# Altium project XXXX.426471.007 Secondary_PCB_Raspberry.PrjPcb
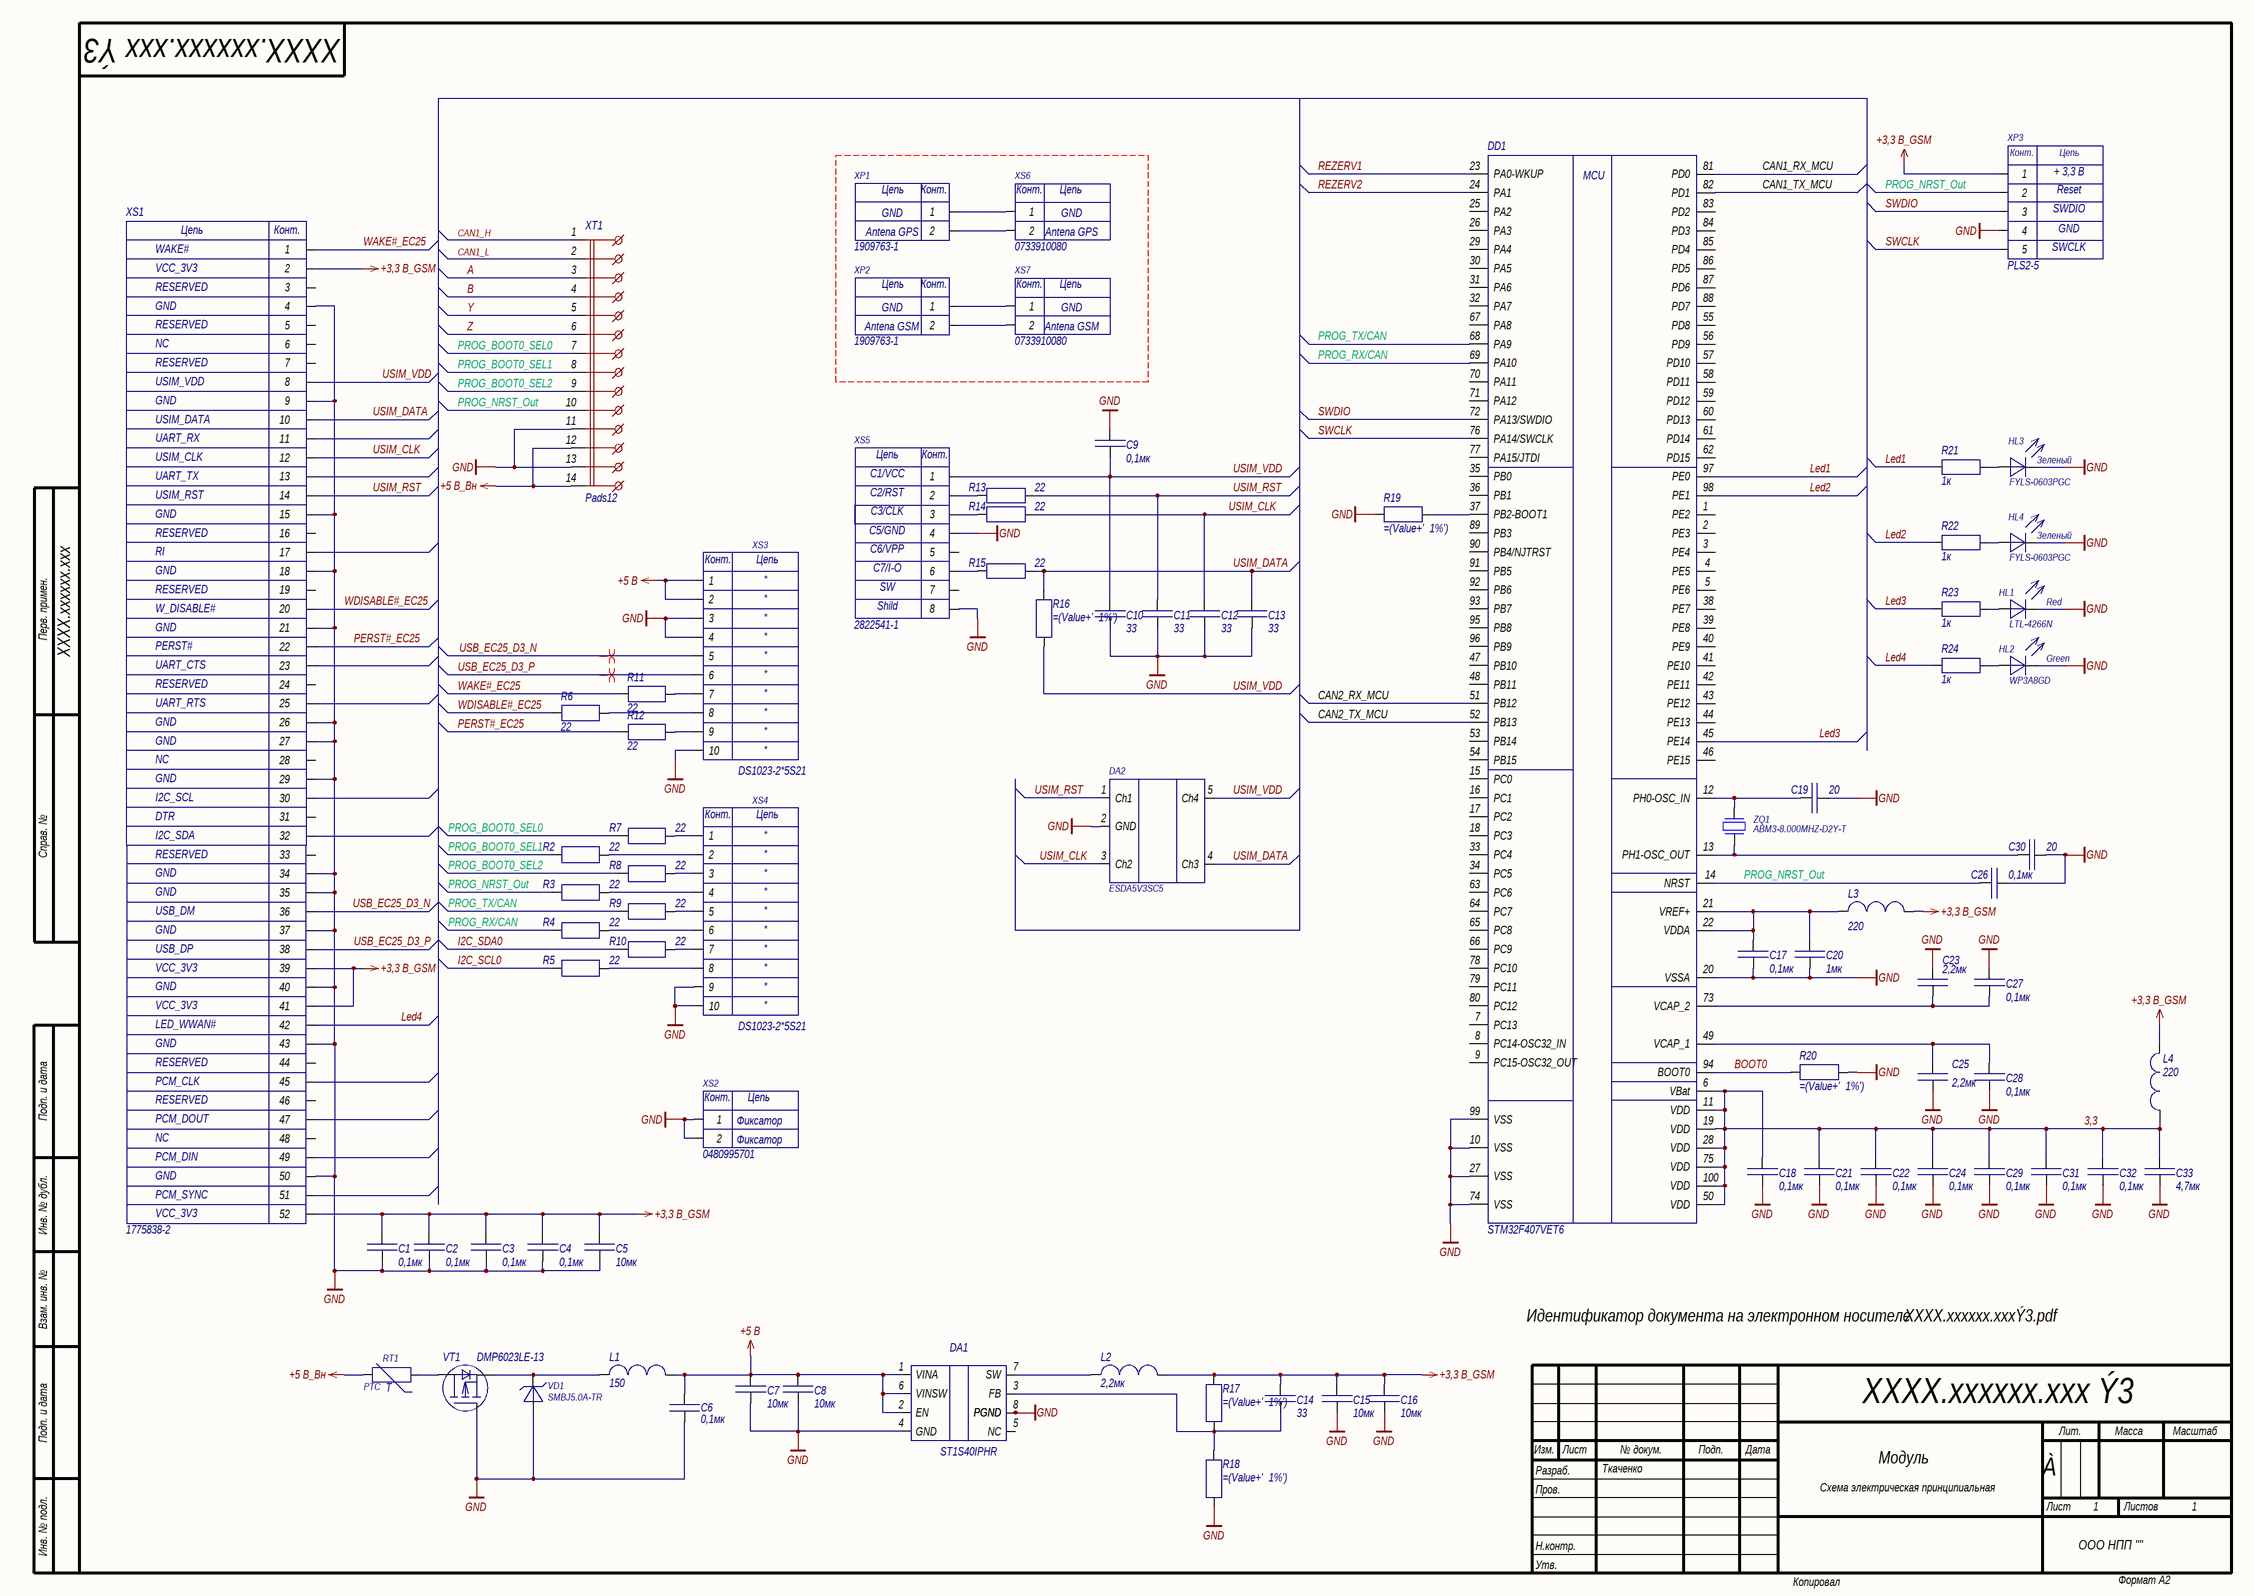
[diagram p0: XXXX.426471.007 Secondary_PCB_Raspberry_List1.SchDoc]
DocumentNumber: XXXX.xxxxxx.xxx Ý3; DocumentType2str: Схема электрическая принципиальная; DrawnBy: Ткаченко; IDENT: XXXX.xxxxxx.xxxÝ3.pdf; ImagePath: XXXX.xxxxxx.xxx; Letter1Column: À; Organization: ООО НПП ''''; pcbvalue: КНТР.777777.123; Title2str: Модуль
1 sheet, 82 parts. Net scope: global (net labels, ports and power ports of the same name join across sheets).
Board file: XXXX.687253.007.PcbDoc

## Sheet XXXX.426471.007 Secondary_PCB_Raspberry_List1.SchDoc
size 594 x 420 mm; DrawnBy: Ткаченко; Organization: ООО НПП ''''; DocumentNumber: XXXX.xxxxxx.xxx Ý3; SheetNumber: 1; SheetTotal: 1; Scale: 1:1; PageSetup: Record=PageOptions|CenterHorizontal=False|CenterVertical=False|PrintScale=0.95|XCorrection=0.00|YCorrection=0.00|PrintKind=1|BorderSize=5000000|LeftOffset=0|BottomOffset=0|Orientation=1|PaperLength=1000|PaperWidth=1000|Scale=100|PaperSource=15|PrintQuality=600|MediaType=1|DitherType=10|PaperKind=A4|PrintScaleMode=1; Title2str: Модуль; DocumentType2str: Схема электрическая принципиальная; TitleProject: Модуль; IDENT: XXXX.xxxxxx.xxxÝ3.pdf; ImagePath: XXXX.xxxxxx.xxx; Rule: PcbType=ProtelPcb

### Parts
C1  0,1мк  [CAPC1608N_SL]
C2  0,1мк  [CAPC1608N_SL]
C3  0,1мк  [CAPC1608N_SL]
C4  0,1мк  [CAPC1608N_SL]
C5  10мк  [CAPC2012N]
C6  0,1мк  [CAPC1608N_sl]
C7  10мк  [CAPC2012N]
C8  10мк  [CAPC2012N]
C9  0,1мк  [CAPC1608N_SL]
C10  33  [CAPC1608N_SL]
C11  33  [CAPC1608N_SL]
C12  33  [CAPC1608N_SL]
C13  33  [CAPC1608N_SL]
C14  33  [CAPC1608N_SL]
C15  10мк  [CAPC2012N]
C16  10мк  [CAPC2012N]
C17  0,1мк  [CAPC1608N_SL]
C18  0,1мк  [CAPC1608N_SL]
C19  20  [CAPC1608N_SL]
C20  1мк  [CAPC1608N_SL]
C21  0,1мк  [CAPC1608N_SL]
C22  0,1мк  [CAPC1608N_SL]
C23  2,2мк  [CAPC1608N_SL]
C24  0,1мк  [CAPC1608N_SL]
C25  2,2мк  [CAPC1608N_SL]
C26  0,1мк  [CAPC1608N_SL]
C27  0,1мк  [CAPC1608N_SL]
C28  0,1мк  [CAPC1608N_SL]
C29  0,1мк  [CAPC1608N_SL]
C30  20  [CAPC1608N_SL]
C31  0,1мк  [CAPC1608N_SL]
C32  0,1мк  [CAPC1608N_SL]
C33  4,7мк  [CAPC1608N_SL]
DA1  ST1S40IPHR  [HSOP-8]
DA2  ESDA5V3SC5  [SOT23-5AN]
DD1  STM32F407VET6  [LQFP100]
HL1  LTL-4266N  NoteSCH: Red  [Led3mm]
HL2  WP3A8GD  NoteSCH: Green  [LED-2.5_G]
HL3  FYLS-0603PGC  NoteSCH: Зеленый  [HL0603_GREEN_SL]
HL4  FYLS-0603PGC  NoteSCH: Зеленый  [HL0603_GREEN_SL]
L1  150  [INDC_56x51]
L2  2,2мк  [sru1048]
L3  220  [L2012N]
L4  220  [L2012N]
R2  22  [RESC1608N_SL]
R3  22  [RESC1608N_SL]
R4  22  [RESC1608N_SL]
R5  22  [RESC1608N_SL]
R6  22  [RESC1608N_SL]
R7  22  [RESC1608N_SL]
R8  22  [RESC1608N_SL]
R9  22  [RESC1608N_SL]
R10  22  [RESC1608N_SL]
R11  22  [RESC1608N_SL]
R12  22  [RESC1608N_SL]
R13  22  [RESC1608N_SL]
R14  22  [RESC1608N_SL]
R15  22  [RESC1608N_SL]
R16  (no value)  [RESC1608N_SL]
R17  (no value)  [RESC1608N_SL]
R18  (no value)  [RESC1608N_SL]
R19  (no value)  [RESC1608N_SL]
R20  (no value)  [RESC1608N_SL]
R21  1к  [RESC1608N_SL]
R22  1к  [RESC1608N_SL]
R23  1к  [RESC1608N_SL]
R24  1к  [RESC1608N_SL]
RT1  PTC  [Fuse_2920]
VD1  SMBJ5.0A-TR  [DO-214AA(SMB)]
VT1  DMP6023LE-13  [SOT230P700X180-3M]
XP1  1909763-1  Net_Name1: GND  Net_Name2: Antena GPS  [1909763-1]
XP2  1909763-1  Net_Name1: GND  Net_Name2: Antena GSM  [1909763-1]
XP3  PLS2-5  Net_Name1: + 3,3 В  Net_Name2: Reset  Net_Name3: SWDIO  Net_Name4: GND  Net_Name5: SWCLK  [PLS2-5]
XS1  1775838-2  Net_Name3: RESERVED  Net_Name4: GND  Net_Name6: NC  Net_Name8: USIM_VDD  Net_Name10: USIM_DATA  Net_Name11: UART_RX  Net_Name12: USIM_CLK  Net_Name13: UART_TX  Net_Name14: USIM_RST  Net_Name17: RI  Net_Name20: W_DISABLE#  Net_Name22: PERST#  Net_Name23: UART_CTS  Net_Name25: UART_RTS  Net_Name30: I2C_SCL  Net_Name31: DTR  Net_Name32: I2C_SDA  Net_Name36: USB_DM  Net_Name38: USB_DP  Net_Name39: VCC_3V3  Net_Name1: WAKE#  Net_Name42: LED_WWAN#  Net_Name45: PCM_CLK  Net_Name47: PCM_DOUT  Net_Name49: PCM_DIN  Net_Name51: PCM_SYNC  [2041119-1CB]
XS2  0480995701  Net_Name1: Фиксатор  [NoPackage]
XS3  DS1023-2*5S21  [pbD-10]
XS4  DS1023-2*5S21  [pbD-10]
XS5  2822541-1  Net_Name1: C1/VCC  Net_Name2: C2/RST  Net_Name3: C3/CLK  Net_Name4: C5/GND  Net_Name5: C6/VPP  Net_Name6: C7/I-O  Net_Name7: SW  Net_Name8: Shild  [2822541-1_MSIM]
XS6  0733910080  Net_Name1: GND  Net_Name2: Antena GPS  [0733910080]
XS7  0733910080  Net_Name1: GND  Net_Name2: Antena GSM  [0733910080]
XT1  Pads12  [pads12]
ZQ1  ABM3-8.000MHZ-D2Y-T  [ABM3]

### Nets
+3,3 В_GSM: C1.1 C2.1 C3.1 C4.1 C5.1 C14.1 C15.1 C16.1 L2.2 L3.2 L4.2 R17.2 XP3.1 XS1.2 XS1.39 XS1.41 XS1.52
+5 В: C6.1 C7.1 C8.1 DA1.1(VINA) DA1.2(EN) DA1.6(VINSW) L1.2 XS3.1 XS3.2
+5 В_Вн: RT1.1 XT1.12 XT1.14
GND: C1.2 C2.2 C3.2 C4.2 C5.2 C6.2 C7.2 C8.2 C9.2 C10.2 C11.2 C12.2 C13.2 C15.2 C16.2 C17.2 C18.2 C19.1 C20.2 C21.2 C22.2 C23.2 C24.2 C25.1 C26.1 C27.1 C28.2 C29.2 C30.1 C31.2 C32.2 C33.2 DA1.4(GND) DA1.8(PGND) DA1.9(PGND) DA2.2(GND) DD1.10(VSS) DD1.20(VSSA) DD1.27(VSS) DD1.74(VSS) DD1.99(VSS) HL1.1 HL2.1 HL3.1 HL4.1 R18.1 R19.1 R20.2 VD1.2(A) VT1.1(G) XP3.4 XS1.4 XS1.9 XS1.15 XS1.18 XS1.21 XS1.26 XS1.27 XS1.29 XS1.34 XS1.35 XS1.37 XS1.40 XS1.43 XS1.50 XS2.1 XS2.2 XS3.3 XS3.4 XS3.10 XS4.9 XS4.10 XS5.4 XS5.8 XT1.11 XT1.13
3,3: C18.1 C21.1 C22.1 C24.1 C29.1 C31.1 C32.1 C33.1 DD1.6(VBat) DD1.11(VDD) DD1.19(VDD) DD1.28(VDD) DD1.50(VDD) DD1.75(VDD) DD1.100(VDD) L4.1
A: XT1.3
B: XT1.4
BOOT0: DD1.94(BOOT0) R20.1
CAN1_H: XT1.1
CAN1_L: XT1.2
CAN1_RX_MCU: DD1.81(PD0)
CAN1_TX_MCU: DD1.82(PD1)
CAN2_RX_MCU: DD1.51(PB12)
CAN2_TX_MCU: DD1.52(PB13)
I2C_SCL0: R5.2
I2C_SDA0: R10.2
Led1: DD1.97(PE0) R21.1
Led2: DD1.98(PE1) R22.1
Led3: DD1.45(PE14) R23.1
Led4: R24.1 XS1.42
PERST#_EC25: R12.2 XS1.22
PROG_BOOT0_SEL0: R7.2 XT1.7
PROG_BOOT0_SEL1: R2.2 XT1.8
PROG_BOOT0_SEL2: R8.2 XT1.9
PROG_NRST_Out: C26.2 DD1.14(NRST) R3.2 XP3.2 XT1.10
PROG_RX/CAN: DD1.69(PA10) R4.2
PROG_TX/CAN: DD1.68(PA9) R9.2
REZERV1: DD1.23(PA0-WKUP)
REZERV2: DD1.24(PA1)
SWCLK: DD1.76(PA14/SWCLK) XP3.5
SWDIO: DD1.72(PA13/SWDIO) XP3.3
USB_EC25_D3_N: XS1.36 XS3.5
USB_EC25_D3_P: XS1.38 XS3.6
USIM_CLK: C12.1 DA2.3(Ch2) R14.2 XS1.12
USIM_DATA: C13.1 DA2.4(Ch3) R15.2 R16.2 XS1.10
USIM_RST: C11.1 DA2.1(Ch1) R13.2 XS1.14
USIM_VDD: C9.1 C10.1 DA2.5(Ch4) R16.1 XS1.8 XS5.1
WAKE#_EC25: R11.2 XS1.1
WDISABLE#_EC25: R6.2 XS1.20
Y: XT1.5
Z: XT1.6
NetC14_2: C14.2 DA1.3(FB) R17.1 R18.2
NetC17_1: C17.1 C20.1 DD1.21(VREF+) DD1.22(VDDA) L3.1
NetC19_2: C19.2 DD1.12(PH0-OSC_IN) ZQ1.2
NetC23_1: C23.1 C27.2 DD1.73(VCAP_2)
NetC25_2: C25.2 C28.1 DD1.49(VCAP_1)
NetC30_2: C30.2 DD1.13(PH1-OSC_OUT) ZQ1.1
NetDA1_7: DA1.7(SW) L2.1
NetDD1_37: DD1.37(PB2-BOOT1) R19.2
NetHL1_2: HL1.2 R23.2
NetHL2_2: HL2.2 R24.2
NetHL3_2: HL3.2 R21.2
NetHL4_2: HL4.2 R22.2
NetL1_1: L1.1 VD1.1(C) VT1.3(S)
NetR2_1: R2.1 XS4.2
NetR3_1: R3.1 XS4.4
NetR4_1: R4.1 XS4.6
NetR5_1: R5.1 XS4.8
NetR6_1: R6.1 XS3.8
NetR7_1: R7.1 XS4.1
NetR8_1: R8.1 XS4.3
NetR9_1: R9.1 XS4.5
NetR10_1: R10.1 XS4.7
NetR11_1: R11.1 XS3.7
NetR12_1: R12.1 XS3.9
NetR13_1: R13.1 XS5.2
NetR14_1: R14.1 XS5.3
NetR15_1: R15.1 XS5.6
NetRT1_2: RT1.2 VT1.2(D)
NetXP1_1: XP1.1 XS6.1
NetXP1_2: XP1.2 XS6.2
NetXP2_1: XP2.1 XS7.1
NetXP2_2: XP2.2 XS7.2

Not connected (* = marked no-connect by the designer): DA1 5(NC); DD1 1(PE2) 2(PE3) 3(PE4) 4(PE5) 5(PE6) 7(PC13) 8(PC14-OSC32_IN) 9(PC15-OSC32_OUT) 15(PC0) 16(PC1) 17(PC2) 18(PC3) 25(PA2) 26(PA3) 29(PA4) 30(PA5) 31(PA6) 32(PA7) 33(PC4) 34(PC5) 35(PB0) 36(PB1) 38(PE7) 39(PE8) 40(PE9) 41(PE10) 42(PE11) 43(PE12) 44(PE13) 46(PE15) 47(PB10) 48(PB11) 53(PB14) 54(PB15) 55(PD8) 56(PD9) 57(PD10) 58(PD11) 59(PD12) 60(PD13) 61(PD14) 62(PD15) 63(PC6) 64(PC7) 65(PC8) 66(PC9) 67(PA8) 70(PA11) 71(PA12) 77(PA15/JTDI) 78(PC10) 79(PC11) 80(PC12) 83(PD2) 84(PD3) 85(PD4) 86(PD5) 87(PD6) 88(PD7) 89(PB3) 90(PB4/NJTRST) 91(PB5) 92(PB6) 93(PB7) 95(PB8) 96(PB9); XS1 3 5 6 7 11 13 16 17 19 23 24 25 28 30 31 32 33 44 45 46 47 48 49 51; XS5 5 7

### Layout directives
differential pair: USB_EC25_D3_N, USB_EC25_D3_P

### Notes on the sheet
- Перв. примен.
- Справ. №
- Подп. и дата
- Инв. № дубл.
- Взам. инв. №
- Идентификатор документа на электронном носителе
- Изм.
- Лист
- № докум.
- Подп.
- Дата
- Лит.
- Масса
- Масштаб
- Пров.
- Разраб.
- Листов
- Инв. № подл.
- Н.контр.
- Утв.
- Копировал
- Формат А2
- (in symbol 2920L600/12MR_Littelfuse) T
- (in symbol 1775838-2_TE Connectivity) Цепь; Конт.
- (in symbol 1909763-1_TE Connectivity) Цепь; Конт.
- (in symbol 2822541-1_TE Connectivity) Цепь; Конт.
- (in symbol 0480995701_Molex) Конт.; Цепь
- (in symbol 0733910080_Molex) Конт.; Цепь
- (in symbol DS1023-2*5S21_CONNFLY) Конт.; Цепь
- (in symbol PLS2-5_CONNFLY) Конт.; Цепь

### Library data of the parts
C1-C4 C6 C9 C17 C18 C21 C22 C24 C26-C29 C31 C32 = CC0603KRX7R9BB104_Yageo: CAP CER 0.1UF 50V 10% X7R 0603; Manufacturer: Yageo; Voltage: 50 В; ValueBOM: Конденсатор CC0603KRX7R9BB104 "Yageo" (0,1 мкФ ± 10 %, 50 В,X7R, SMD 0603); Sorting: 100000; Автор: Хоменко С.П.; Количество1: 10; Цена1: 0,027; Количество2: 100; Цена2: 0,0125; Разрешен к применению: True; PartNumber: CC0603KRX7R9BB104_Yageo; ManufacturerPartNumber: CC0603KRX7R9BB104; ComponentLink3URL: http://www.yageo.com/documents/recent/UPY-GPHC_X7R_6.3V-to-50V-v12.pdf; ComponentLink3Description: Datasheet; Value: 0,1мк; Tolerance: ± 10 %; TKE: X7R; ComponentLink2Description: Manufacturer Link; ComponentLink2URL: http://www.yageo.com/; Operating Temperature: -55°C ~ +125°C; Modify: 06.07.2015; Supplier: Digi-Key; Supplier P/N: 311-1344-1-ND
C5 C7 C8 C15 C16 = GCM21BR71A106KE22L_Murata Electronics: CAP CER 10UF 10V 10% X7R 0805; Voltage: 10 В; ValueBOM: Конденсатор GCM21BR71A106KE22L "Murata Electronics" (10 мкФ ± 10 %, 10 В, X7R, SMD 0805); Sorting: 10000000; Автор: Хоменко С.П.; Количество1: 10; Цена1: 0,496; Количество2: 50; Цена2: 0,296; Разрешен к применению: False; PartNumber: GCM21BR71A106KE22L_Murata Electronics; Manufacturer: Murata Electronics; ManufacturerPartNumber: GCM21BR71A106KE22L; ComponentLink3URL: http://search.murata.co.jp/Ceramy/image/img/w_hinm/S0717E.pdf; ComponentLink3Description: Datasheet; Value: 10мк; Tolerance: ± 10 %; TKE: X7R; ComponentLink2Description: Manufacturer Link; ComponentLink2URL: http://www.murata.com/; Operating Temperature: -55°C ~ +125°C; Modify: 07.09.2015; Supplier: Digi-Key; Supplier P/N: 490-10674-1-ND
C10-C14 = CC0603JRNPO9BN330_Yageo: CAP CER 33PF 50V NPO 0603; Manufacturer: Yageo; Tolerance: ± 5 %; Voltage: 50 В; TKE: NP0; ValueBOM: Конденсатор CC0603JRNPO9BN330 "Yageo" (33 пФ ± 5 %, 50 В, NP0, SMD 0603); Автор: Хоменко С.П.; Количество1: 10; Цена1: 0,029; Количество2: 25; Цена2: 0,0204; Разрешен к применению: True; PartNumber: CC0603JRNPO9BN330_Yageo; ManufacturerPartNumber: CC0603JRNPO9BN330; ComponentLink3URL: http://www.yageo.com/documents/recent/UPY-GP_NP0_16V-to-50V_10.pdf; ComponentLink3Description: Datasheet; Value: 33; ComponentLink2Description: Manufacturer Link; ComponentLink2URL: http://www.yageo.com/; Operating Temperature: -55°C ~ +125°C; Modify: 22.01.2016; Supplier: Digi-Key; Supplier P/N: 311-1064-1-ND; Sorting: 33
C19 C30 = CC0603JRNPO9BN200_Yageo: CAP CER 20PF 50V 5% NPO 0603; Manufacturer: Yageo; Voltage: 50 В; TKE: NP0; ValueBOM: Конденсатор CC0603JRNPO9BN200 "Yageo" (20 пФ ± 10 %, 50 В,NP0, SMD 0603); Автор: Хоменко С.П.; Количество1: 10; Цена1: 0,031; Количество2: 25; Цена2: 0,0216; Разрешен к применению: True; PartNumber: CC0603JRNPO9BN200_Yageo; ManufacturerPartNumber: CC0603JRNPO9BN200; ComponentLink3URL: http://www.yageo.com/documents/recent/UPY-GPHC_X7R_6.3V-to-50V-v12.pdf; ComponentLink3Description: Datasheet; Value: 20; Tolerance: ± 5 %; ComponentLink2Description: Manufacturer Link; ComponentLink2URL: http://www.yageo.com/; Operating Temperature: -55°C ~ +125°C; Modify: 12.08.2015; Supplier: Digi-Key; Supplier P/N: 311-1424-1-ND; Sorting: 20
C20 = CC0603KRX7R7BB105_Yageo: CAP CER 1UF 16V 10% X7R 0603; Manufacturer: Yageo; Voltage: 16 В; ValueBOM: Конденсатор CC0603KRX7R7BB105 "Yageo" (1 мкФ ± 10 %, 16 В,X7R, SMD 0603); Sorting: 1000000; Автор: Хоменко С.П.; Количество1: 10; Цена1: 0,44; Количество2: 25; Цена2: 0,031; Разрешен к применению: True; PartNumber: CC0603KRX7R7BB105_Yageo; ManufacturerPartNumber: CC0603KRX7R7BB105; ComponentLink3URL: http://www.yageo.com/documents/recent/UPY-GPHC_X7R_6.3V-to-50V-v12.pdf; ComponentLink3Description: Datasheet; Value: 1мк; Tolerance: ± 10 %; TKE: X7R; ComponentLink2Description: Manufacturer Link; ComponentLink2URL: http://www.yageo.com/; Operating Temperature: -55°C ~ +125°C; Modify: 12.08.2015 16:30:29; Supplier: Digi-Key; Supplier P/N: 311-1446-1-ND
C23 C25 = GRM188R71A225KE15D_Murata Electronics: CAP CER 2.2UF 10V X7R 0603; Tolerance: ± 10 %; Voltage: 10 В; ValueBOM: Конденсатор GRM188R71A225KE15D "Murata Electronics" (2,2 мкФ ± 10 %, 10 В, X7R, SMD 0603); Sorting: 2200000; Автор: Хоменко С.П.; Количество1: 1; Цена1: 0,34; Количество2: 10; Цена2: 0,28; Разрешен к применению: False; PartNumber: GRM188R71A225KE15D_Murata Electronics; Manufacturer: Murata Electronics; ManufacturerPartNumber: GRM188R71A225KE15D; ComponentLink3URL: http://www.murata.com/~/media/webrenewal/support/library/catalog/products/capacitor/mlcc/c02e.pdf; ComponentLink3Description: Datasheet; Value: 2,2мк; TKE: X7R; ComponentLink2Description: Manufacturer Link; ComponentLink2URL: http://www.murata.com/; Operating Temperature: -55°C ~ +125°C; Modify: 29.03.2016 8:54:49; Supplier: Digi-Key; Supplier P/N: 490-4520-1-ND
C33 = CC0603KRX5R6BB475_Yageo: CAP CER 4.7UF 10V 10% X5R 0603; Manufacturer: Yageo; Voltage: 10 В; ValueBOM: Конденсатор CC0603KRX5R6BB475 "Yageo" (4,7 мкФ ± 10 %, 10 В, X5R, SMD 0603); Sorting: 4700000; Автор: Хоменко С.П.; Количество1: 1; Цена1: 0,14; Количество2: 10; Цена2: 0,095; Разрешен к применению: False; PartNumber: CC0603KRX5R6BB475_Yageo; ManufacturerPartNumber: CC0603KRX5R6BB475; ComponentLink3URL: http://www.yageo.com/documents/recent/UPY-GPHC_X5R_4V-to-50V_19.pdf; ComponentLink3Description: Datasheet; Value: 4,7мк; Tolerance: ± 10 %; TKE: X5R; ComponentLink2Description: Manufacturer Link; ComponentLink2URL: http://www.yageo.com/; Operating Temperature: -55°C ~ +125°C; Modify: 12.08.2015 16:02:03; Supplier: Digi-Key; Supplier P/N: 311-1455-1-ND
DA1 = ST1S40IPHR_STMicroelectronics: IC REG BUCK ADJ 3A SYNC 8-HSOP; ValueBOM: Микросхема  ST1S40IPHR STMicroelectronics; Expr1007: 3,0  - 18  В; Автор: Ткаченко М.; Количество1: 1; Цена1: 1,6; Количество2: 10; Цена2: 1,5; Разрешен к применению: True; PartNumber: ST1S40IPHR_STMicroelectronics; ManufacturerPartNumber: ST1S40IPHR; Manufacturer: STMicroelectronics; ComponentLink3URL: http://www.st.com/content/ccc/resource/technical/document/datasheet/56/bd/d6/2b/e1/d4/49/d9/CD00284753.pdf/files/CD00284753.pdf/_jcr_content/translations/en.CD00284753.pdf; ComponentLink3Description: Datasheet; Value: ST1S40IPHR; Expr1008: 3 A; ComponentLink2Description: Manufacturer Link; ComponentLink2URL: http://www.st.com; Operating Temperature: -40°C ~ +85°C; Modify: 07.08.2017 17:29:54; Supplier: Digi-Key; Supplier P/N: 497-13025-1-ND; Voltage: 3,0  - 18  В; Current: 3 A; Package: HSOP-8; SMD mounting: True
DA2 = ESDA5V3SC5_STMicroelectronics: TVS DIODE 3V SOT23-5L; ValueBOM: TVS диод ESDA5V3SC5 "STMicroelectronics" SOT23-5; Marking: EC53; Voltage: 5,0 В; Current: 500 W; Автор: Ткаченко М.; Количество1: 1; Цена1: 0,42; Количество2: 10; Цена2: 0,35; Разрешен к применению: True; PartNumber: ESDA5V3SC5_STMicroelectronics; ManufacturerPartNumber: ESDA5V3SC5; Manufacturer: STMicroelectronics; ComponentLink3Description: Datasheet; Value: ESDA5V3SC5; ComponentLink2Description: Manufacturer Link; ComponentLink2URL: http://www.st.com; Operating Temperature: -40°C ~ +85°C; Modify: 15.04.2019 14:38:55; Supplier: Digi-Key; Supplier P/N: 497-7746-1-ND; Package Description: Корпус SOT23-5
DD1 = STM32F407VET6_STMicroelectronics: STM32F407VET6, Микроконтроллер 32-Бит, Cortex-M4 + FPU, 168МГц, 512КБ Flash, USB OTG HS/FS, Ethernet [LQFP-100]; ValueBOM: Микросхема  STM32F407VET6 "STMicroelectronics"; Voltage: 3,3 В; Автор: Ткаченко М.; Количество1: 1; Цена1: 7,5; Количество2: 10; Разрешен к применению: True; Current: 150 мА; PartNumber: STM32F407VET6_STMicroelectronics; ManufacturerPartNumber: STM32F407VET6; Manufacturer: STMicroelectronics; ComponentLink3URL: https://www.st.com/content/ccc/resource/technical/document/datasheet/ef/92/76/6d/bb/c2/4f/f7/DM00037051.pdf/files/DM00037051.pdf/jcr:content/translations/en.DM00037051.pdf; ComponentLink3Description: Datasheet; Value: STM32F407VET6; ComponentLink2Description: Manufacturer Link; ComponentLink2URL: http://www.st.com; Operating Temperature: -40°C ~ +85°C; Modify: 19.03.2019 12:03:35; Supplier: ChipDip; Supplier P/N: 9000135994; Цена2: 7,5; ClassName: MCU
HL1 = LTL-4266N_LITE_ON: Red 638nm LED Indication - Discrete 1.8V Radial; ValueBOM: Светодиод LTL-4266N "LITE_ON", красный; Voltage: 1,8 В; Current: 20 мА; Автор: Ткаченко М.; Количество1: 1; Цена1: 0,5; Количество2: 10; Цена2: 0,35; Разрешен к применению: True; PartNumber: LTL-4266N_LITE_ON; ManufacturerPartNumber: LTL-4266N; Manufacturer: LITE_ON; ComponentLink3URL: https://media.digikey.com/pdf/Data%20Sheets/Lite-On%20PDFs/LTL-4266N.pdf; ComponentLink3Description: Datasheet; Value: LTL-4266N; ComponentLink2Description: Manufacturer Link; Operating Temperature: -40°C ~ +85°C; Expr1015: 09.04.2019 15:38:59; Supplier: Digi-Key; Supplier P/N: 160-1034-ND; Modify: 09.04.2019 15:38:59
HL2 = WP3A8GD_Kingbright: Green 568nm LED Indication - Discrete 2.2V Radial; ValueBOM: Светодиод WP3A8GD "Kingbright", зеленый; Voltage: 2,2 В; Current: 20 мА; Автор: Ткаченко М.; Количество1: 1; Цена1: 0,49; Количество2: 10; Цена2: 0,35; Разрешен к применению: True; PartNumber: WP3A8GD_Kingbright; ManufacturerPartNumber: WP3A8GD; Manufacturer: Kingbright; ComponentLink3URL: http://www.kingbrightusa.com/images/catalog/SPEC/WP3A8GD.pdf; ComponentLink3Description: Datasheet; Value: WP3A8GD; ComponentLink2Description: Manufacturer Link; ComponentLink2URL: http://www.kingbrightusa.com/; Operating Temperature: -40°C ~ +85°C; Expr1015: 09.04.2019 15:47:55; Supplier: Digi-Key; Supplier P/N: 754-1217-ND; Package Description: Светодиод 3 мм Зеленый; Modify: 09.04.2019 15:47:55
HL3 HL4 = FYLS-0603PGC_Foryard Optoelectronics: Светодиод маломощный зеленный 360mcd; ValueBOM: Светодиод FYLS-0603PGC "Foryard Optoelectronics" SMD 0603; Автор: Хоменко С.П.; Количество1: 0; Количество2: 2000; Цена2: 0,02; Разрешен к применению: True; PartNumber: FYLS-0603PGC_Foryard Optoelectronics; ManufacturerPartNumber: FYLS-0603PGC; Manufacturer: Foryard Optoelectronics; ComponentLink3URL: http://foryard.com/f_FYLS-0603PGC.pdf; ComponentLink3Description: Datasheet; Value: FYLS-0603PGC; ComponentLink2Description: Manufacturer Link; ComponentLink2URL: http://foryard.com; Operating Temperature: -40°C ~ +85°C; Expr1015: 17.08.2015 12:18:50; Supplier: Compel; Package Description: Chip Led, 2-Leads, Body 1.6x0.8mm, IPC Medium Density; Цена1: 0; Modify: 17.08.2015 12:18:50
L1 = 74279224151_Wurth-Electronics-Inc: Tolerance: ± 20 %; ValueBOM: Индуктивность 74279224151 Wurth-Electronics-Inc; Sorting: 1; Автор: Ткаченко М.; Цена1: 1,23; Количество2: 10; Цена2: 1,19; Разрешен к применению: True; PartNumber: 74279224151_Wurth-Electronics-Inc; Manufacturer: Wurth-Electronics-Inc; ManufacturerPartNumber: 74279224151; ComponentLink3URL: http://katalog.we-online.de/pbs/datasheet/74279224151.pdf; ComponentLink3Description: Datasheet; Value: 150; ComponentLink2Description: Manufacturer Link; ComponentLink2URL: http://www.we-online.com/web/en/wuerth_elektronik/start.php; Operating Temperature: -55°C ~ +125°C; Modify: 02.06.2016 17:10:51; Supplier: Digi-Key; Supplier P/N: 732-3423-1-ND; Количество1: 1
L2 = SRU1048-2R2Y_Bourns Inc.: FIXED IND 2.2UH 6.5A 5.3 MOHM; Tolerance: ± 20 %; ValueBOM: Дроссель SRU1048-2R2Y "Bourns Inc." (2,2мкГн, ± 20 %, 6,5 А ); Sorting: 2,20000004768372; Автор: Ткаченко М.; Количество1: 1; Цена1: 1,02; Количество2: 10; Цена2: 0,95; Разрешен к применению: True; PartNumber: SRU1048-2R2Y_Bourns Inc.; Manufacturer: Bourns Inc.; ManufacturerPartNumber: SRU1048-2R2Y; ComponentLink3URL: https://www.bourns.com/docs/Product-Datasheets/SRU1048.pdf; ComponentLink3Description: Datasheet; Value: 2,2мк; ComponentLink2Description: Manufacturer Link; ComponentLink2URL: http://www.bourns.com; Operating Temperature: -40°C ~ +125°C; Modify: 10.04.2019 21:50:26; Supplier: Digi-Key; Supplier P/N: SRU1048-2R2YCT-ND
L3 L4 = BLM21PG221SN1D_Murata Electronics: FERRITE BEAD 220 OHM 0805 2A; Tolerance: ± 25 %; ValueBOM: Индуктивность BLM21PG221SN1D "Murata Electronics" (220Гн, ± 25 %, SMD 0805); Sorting: 2; Автор: Хоменко С.П.; Количество1: 10; Цена1: 0,09; Количество2: 50; Цена2: 0,0732; Разрешен к применению: True; PartNumber: BLM21PG221SN1D_Murata Electronics; Manufacturer: Murata Electronics; ManufacturerPartNumber: BLM21PG221SN1D; ComponentLink3URL: http://search.murata.co.jp/Ceramy/image/img/PDF/ENG/L0110S0100BLM21P.pdf; ComponentLink3Description: Datasheet; Value: 220; ComponentLink2Description: Manufacturer Link; ComponentLink2URL: http://www.murata.com/; Operating Temperature: -55°C ~ +125°C; Modify: 02.02.2016; Supplier: Digi-Key; Supplier P/N: 490-1054-1-ND; Package Description: Chip Ferrite Bead SMD0805, Body 2.0x1.3mm, IPC Medium Density
R2-R15 = RC0603JR-0722RL_Yageo: RES SMD 22 OHM 5% 1/10W 0603; Manufacturer: Yageo; Power: 0,1 Вт; ValueBOM: Резистор RC0603JR-0722RL "Yageo" (22 Ом ± 5 %, 0,1 Вт SMD 0603); ТКС: ±100ppm/C°; Marking: 220; Автор: Хоменко С.П.; Количество1: 10; Цена1: 0,011; Количество2: 25; Цена2: 0,008; Разрешен к применению: True; PartNumber: RC0603JR-0722RL_Yageo; ManufacturerPartNumber: RC0603JR-0722RL; ComponentLink3URL: http://www.yageo.com/NewPortal/yageodocoutput?fileName=/pdf/R-Chip/PYu-RC_Group_51_RoHS_L_3.pdf; ComponentLink3Description: Datasheet; Value: 22; Tolerance: ± 5 %; ComponentLink2Description: Manufacturer Link; ComponentLink2URL: http://www.yageo.com/; Operating Temperature: -55°C ~ +125°C; Modify: 12.08.2015 22:38:32; Supplier: Digi-Key; Supplier P/N: 311-22GRCT-ND; Sorting: 22; Package Description: Chip Resistor, Body 1.6x0.8mm, IPC Medium Density
R16 R18-R20 = RC0603FR-0715KL_Yageo: RES SMD 15K OHM 1% 1/10W 0603; Manufacturer: Yageo; Value: 15к; Power: 0,1 Вт; ValueBOM: Резистор RC0603FR-0715KL "Yageo" (15 кОм ± 1 %, 0,1 Вт SMD 0603); ТКС: ±100ppm/C°; Marking: 1502; Sorting: 15000; Автор: Хоменко С.П.; Количество1: 10; Цена1: 0,014; Количество2: 25; Цена2: 0,01; Разрешен к применению: True; PartNumber: RC0603FR-0715KL_Yageo; ManufacturerPartNumber: RC0603FR-0715KL; ComponentLink3URL: http://www.yageo.com/NewPortal/yageodocoutput?fileName=/pdf/R-Chip/PYu-RC_Group_51_RoHS_L_3.pdf; ComponentLink3Description: Datasheet; Tolerance: ± 1 %; ComponentLink2Description: Manufacturer Link; ComponentLink2URL: http://www.yageo.com/; Operating Temperature: -55°C ~ +155°C; Modify: 26.01.2016; Supplier: Digi-Key; Package Description: Chip Resistor, Body 1.6x0.8mm, IPC Medium Density
R17 = RC0603FR-0747KL_Yageo: RES SMD 47K OHM 1% 1/10W 0603; Manufacturer: Yageo; Value: 47к; Power: 0,1 Вт; ValueBOM: Резистор RC0603FR-0747KL "Yageo" (47 кОм ± 1 %, 0,1 Вт SMD 0603); ТКС: ±100ppm/C°; Marking: 4702; Sorting: 47000; Автор: Ткаченко М.; Количество1: 10; Цена1: 0,014; Количество2: 25; Цена2: 0,01; Разрешен к применению: True; PartNumber: RC0603FR-0747KL_Yageo; ManufacturerPartNumber: RC0603FR-0747KL; ComponentLink3URL: http://www.yageo.com/NewPortal/yageodocoutput?fileName=/pdf/R-Chip/PYu-RC_Group_51_RoHS_L_3.pdf; ComponentLink3Description: Datasheet; Tolerance: ± 1 %; ComponentLink2Description: Manufacturer Link; ComponentLink2URL: http://www.yageo.com/; Operating Temperature: -55°C ~ +155°C; Modify: 10.09.2015; Supplier: Digi-Key; Supplier P/N: 311-56KHRCT-ND; Package Description: Chip Resistor, Body 1.6x0.8mm, IPC Medium Density
R21-R24 = RC0603JR-071KL_Yageo: RES SMD 1K OHM 5% 1/10W 0603; Manufacturer: Yageo; Power: 0,1 Вт; ValueBOM: Резистор RC0603JR-071KL "Yageo" (1 кОм ± 5 %, 0,1 Вт SMD 0603); ТКС: ±100ppm/C°; Marking: 103; Sorting: 1000; Автор: Хоменко С.П.; Количество1: 10; Цена1: 0,011; Количество2: 25; Цена2: 0,008; Разрешен к применению: True; PartNumber: RC0603JR-071KL_Yageo; ManufacturerPartNumber: RC0603JR-071KL; ComponentLink3URL: http://www.yageo.com/NewPortal/yageodocoutput?fileName=/pdf/R-Chip/PYu-RC_Group_51_RoHS_L_3.pdf; ComponentLink3Description: Datasheet; Value: 1к; Tolerance: ± 5 %; ComponentLink2Description: Manufacturer Link; ComponentLink2URL: http://www.yageo.com/; Operating Temperature: -55°C ~ +125°C; Modify: 12.08.2015 22:38:32; Supplier: Digi-Key; Supplier P/N: 311-1.0KGRCT-ND; Package Description: Chip Resistor, Body 1.6x0.8mm, IPC Medium Density
RT1 = 2920L600/12MR_Littelfuse: PTC RESET FUSE 12V 6A 2920; Voltage: 12 В; ValueBOM: PTC предохранитель 2920L600/12MR "Littelfuse" (6 А, 12 В); Marking: LF600; Автор: Ткаченко М.; Количество1: 1; Цена1: 0,88; Количество2: 10; Цена2: 0,85; Разрешен к применению: True; PartNumber: 2920L600/12MR_Littelfuse; Manufacturer: Littelfuse; ManufacturerPartNumber: 2920L600/12MR; ComponentLink3Description: Datasheet; Value: 2920L600/12MR; Current: 6 A; ComponentLink2Description: Manufacturer Link; ComponentLink2URL: http://www.littelfuse.com/; Operating Temperature: -40°C ~ +150°C; Modify: 10.04.2019 18:02:19; Supplier: Digi-Key; Supplier P/N: F8137CT-ND
VD1 = SMBJ5.0A-TR_STMicroelectronics: TVS DIODE 5VWM 13.4VC DO214AA; ValueBOM: TVS диод SMBJ5.0A-TR STMicroelectronics; Marking: BUZ; Автор: Хоменко С.П.; Количество1: 10; Цена1: 0,27; Количество2: 100; Цена2: 0,151; Разрешен к применению: True; PartNumber: SMBJ5.0A-TR_STMicroelectronics; ManufacturerPartNumber: SMBJ5.0A-TR; Manufacturer: STMicroelectronics; ComponentLink3URL: http://www.st.com/web/en/resource/technical/document/datasheet/CD00001366.pdf; ComponentLink3Description: Datasheet; Value: SMBJ5.0A-TR; ComponentLink2Description: Manufacturer Link; ComponentLink2URL: http://www.st.com; Operating Temperature: -55°C ~ +150°C; Modify: 27.08.2015; Supplier: Digi-Key; Supplier P/N: 497-3145-1-ND; Package Description: Корпус DO-214AA
VT1 = DMP6023LE-13_Diodes Incorporated: Транзистор P-канальный; ValueBOM: Транзистор DMP6023LE-13 Diodes Incorporated; Expr1007: -60 В; Expr1008: -7A; Expr1013: False; Автор: Ткаченко М.; Количество1: 1; Цена1: 0,77; Количество2: 10; Цена2: 0,68; PartNumber: DMP6023LE-13_Diodes Incorporated; ManufacturerPartNumber: DMP6023LE-13; Manufacturer: Diodes Incorporated; ComponentLink3URL: http://www.diodes.com/_files/datasheets/DMP6023LE.pdf; ComponentLink3Description: Datasheet; Value: DMP6023LE-13; ComponentLink2Description: Manufacturer Link; ComponentLink2URL: http://www.diodes.com/; Operating Temperature: -55°C ~ +150°C; Marking: DMP6023LE-13; Modify: 31.05.2016 11:19:03; Supplier: Digi-Key; Supplier P/N: DMP6023LE-13DICT-ND; Package Description: SOT223, 4-Leads, Body 6,45x7,00mm (avg), Pitch 2,30mm, IPC Low Density; Voltage: -60 В; Current: -7A; Разрешен к применению: False
XP1 XP2 = 1909763-1_TE Connectivity: CONN UMCC JACK STR 50OHM SMD; ValueBOM: Розетка  	1909763-1 "TE Connectivit ( 50 Ом, UMCC ); Автор: Ткаченко М.; Количество1: 1; Цена1: 0,5; Количество2: 10; Цена2: 0,47; Разрешен к применению: True; PartNumber: 1909763-1_TE Connectivity; ManufacturerPartNumber: 1909763-1; Manufacturer: TE Connectivity; ComponentLink3URL: https://ru.mouser.com/datasheet/2/418/NG_CD_1909763_B3-619313.pdf; ComponentLink3Description: Datasheet; Value: 1909763-1; ComponentLink2Description: Manufacturer Link; ComponentLink2URL: http://www.te.com/usa-en/home.html; Operating Temperature: -40°C ~ +85°C; Modify: 11.04.2019 12:15:01; Supplier: Digi-Key; Supplier P/N: A118077CT-ND
XP3 = PLS2-5_CONNFLY: ValueBOM: Вилка  PLS2-5 "CONNFLY"; Количество1: 1; Цена1: 0; Количество2: 10; Разрешен к применению: True; PartNumber: PLS2-5_CONNFLY; ManufacturerPartNumber: PLS2-5; Manufacturer: CONNFLY; ComponentLink3URL: http://www.platan.ru/pdf/datasheets/xn/113.pdf; ComponentLink3Description: Datasheet; Value: PLS2-5; ComponentLink2Description: Manufacturer Link; ComponentLink2URL: http://www.connfly.com/; Operating Temperature: -40°C ~ +100°C; Modify: 01.06.2016 11:25:57; Цена2: 0
XS1 = 1775838-2_TE Connectivity: CONN PCI EXP MINI FEMALE 52POS; ValueBOM: Розетка  1775838-2 "TE Connectivity"; Автор: Ткаченко М.; Количество1: 1; Цена1: 0,81; Количество2: 10; Цена2: 0,72; Разрешен к применению: True; Net_Name5: RESERVED; Net_Name7: RESERVED; Net_Name9: GND; Net_Name15: GND; Net_Name16: RESERVED; Net_Name18: GND; Net_Name19: RESERVED; Net_Name21: GND; Net_Name24: RESERVED; Net_Name26: GND; Net_Name27: GND; Net_Name28: NC; Net_Name29: GND; Net_Name33: RESERVED; Net_Name34: GND; Net_Name35: GND; Net_Name37: GND; Net_Name40: GND; Net_Name2: VCC_3V3; Net_Name41: VCC_3V3; Net_Name43: GND; Net_Name44: RESERVED; Net_Name46: RESERVED; Net_Name48: NC; Net_Name50: GND; Net_Name52: VCC_3V3; PartNumber: 1775838-2_TE Connectivity; ManufacturerPartNumber: 1775838-2; Manufacturer: TE Connectivity; ComponentLink3URL: https://www.te.com/commerce/DocumentDelivery/DDEController?Action=srchrtrv&DocNm=1775838&DocType=Customer+Drawing&DocLang=English; ComponentLink3Description: Datasheet; Value: 1775838-2; ComponentLink2Description: Manufacturer Link; ComponentLink2URL: http://www.te.com/usa-en/home.html; Operating Temperature: -40°C ~ +85°C; Modify: 11.04.2019 22:00:08; Supplier: Digi-Key; Supplier P/N: A123340CT-ND
XS2 = 0480995701_Molex: Connector Latch For PCI Express Mini Card; Manufacturer: Molex; ValueBOM: Фиксатор  	0480995701 "Molex"; Автор: Ткаченко М.; Количество1: 1; Цена1: 1,71; Количество2: 10; Цена2: 1,56; Разрешен к применению: True; Net_Name2: Фиксатор; PartNumber: 0480995701_Molex; ManufacturerPartNumber: 0480995701; ComponentLink3URL: https://media.digikey.com/pdf/Data%20Sheets/Molex%20PDFs/480995701_Dwg.pdf; ComponentLink3Description: Datasheet; Value: 0480995701; ComponentLink2Description: Manufacturer Link; ComponentLink2URL: http://www.molex.com/; Operating Temperature: -40°C ~ +85°C; Modify: 11.04.2019 22:04:32; Supplier: Digi-Key; Supplier P/N: WM3733CT-ND
XS3 XS4 = DS1023-2*5S21_CONNFLY: ValueBOM: Розетка  DS1023-2*5S21 "CONNFLY"; Количество1: 1; Цена1: 0,2; Количество2: 10; Разрешен к применению: True; Net_Name1: *; Net_Name2: *; Net_Name3: *; Net_Name4: *; Net_Name5: *; Net_Name6: *; Net_Name7: *; Net_Name8: *; Net_Name9: *; Net_Name10: *; PartNumber: DS1023-2*5S21_CONNFLY; ManufacturerPartNumber: DS1023-2*5S21; Manufacturer: CONNFLY; ComponentLink3URL: https://static.chipdip.ru/lib/226/DOC000226931.pdf; ComponentLink3Description: Datasheet; Value: DS1023-2*5S21; ComponentLink2Description: Manufacturer Link; ComponentLink2URL: http://www.connfly.com/; Operating Temperature: -40°C ~ +85°C; Modify: 15.04.2019 11:33:58; Supplier: ChipDip; Supplier P/N: 60838; Цена2: 0,2
XS5 = 2822541-1_TE Connectivity: 7 (6 + 1) Position Card Connector Micro SIM Surface Mount, Right Angle Gold; ValueBOM: Розетка  2822541-1 "TE Connectivity"; Автор: Ткаченко М.; Количество1: 1; Цена1: 1,35; Количество2: 10; Цена2: 1,2; Разрешен к применению: True; PartNumber: 2822541-1_TE Connectivity; ManufacturerPartNumber: 2822541-1; Manufacturer: TE Connectivity; ComponentLink3URL: https://www.te.com/commerce/DocumentDelivery/DDEController?Action=srchrtrv&DocNm=2822541&DocType=Customer+Drawing&DocLang=English; ComponentLink3Description: Datasheet; Value: 2822541-1; ComponentLink2Description: Manufacturer Link; ComponentLink2URL: http://www.te.com/usa-en/home.html; Operating Temperature: -40°C ~ +85°C; Modify: 15.04.2019 13:36:21; Supplier: Digi-Key; Supplier P/N: A141365CT-ND
XS6 XS7 = 0733910080_Molex: SMA Connector Jack, Female Socket 50 Ohm Through Hole, Right Angle Solder; Manufacturer: Molex; ValueBOM: Розетка  0733910080 "Molex" (S	MA Jack); Автор: Ткаченко М.; Количество1: 1; Цена1: 3,71; Количество2: 10; Цена2: 3,56; Разрешен к применению: True; PartNumber: 0733910080_Molex; ManufacturerPartNumber: 0733910080; ComponentLink3URL: https://www.molex.com/pdm_docs/sd/733910080_sd.pdf; ComponentLink3Description: Datasheet; Value: 0733910080; ComponentLink2Description: Manufacturer Link; ComponentLink2URL: http://www.molex.com/; Operating Temperature: -40°C ~ +85°C; Modify: 11.04.2019 13:32:53; Supplier: Digi-Key; Supplier P/N: WM4088-ND
XT1 = pads12_Контактмодуль: ValueBOM: Штырь; Автор: Ткаченко М.; Количество1: 1; Цена1: 0; Количество2: 10; Разрешен к применению: True; PartNumber: pads12_Контактмодуль; ManufacturerPartNumber: pads12; Manufacturer: Контактмодуль; ComponentLink3Description: Datasheet; Value: pads12; ComponentLink2Description: Manufacturer Link; Modify: 20.03.2019 13:49:03; Цена2: 0
ZQ1 = ABM3-8.000MHZ-D2Y-T_Abracon LLC: 8MHz ±20ppm Crystal 18pF 140 Ohm -40°C ~ 85°C Surface Mount 2-SMD; ValueBOM: Резонатор кварцевый ABM3-8.000MHZ-D2Y-T "Abracon LLC"; Автор: Хоменко С.П.; Количество1: 1; Цена1: 0,69; Количество2: 10; Цена2: 0,579; Разрешен к применению: True; PartNumber: ABM3-8.000MHZ-D2Y-T_Abracon LLC; Manufacturer: Abracon LLC; ManufacturerPartNumber: ABM3-8.000MHZ-D2Y-T; ComponentLink3URL: http://www.abracon.com/Resonators/abm3.pdf; ComponentLink3Description: Datasheet; Value: ABM3-8.000MHZ-D2Y-T; Tolerance: ±20ppm; ComponentLink2Description: Manufacturer Link; ComponentLink2URL: http://www.abracon.com; Operating Temperature: -40°C ~ +85°C; Modify: 20.01.2016; Supplier: Digi-Key; Supplier P/N: 535-10630-1-ND; Package Description: MINIATURE CERAMIC SMD CRYSTAL 5x3.2 mm